# EAGLE design rt_ctl (EAGLE 5.06)
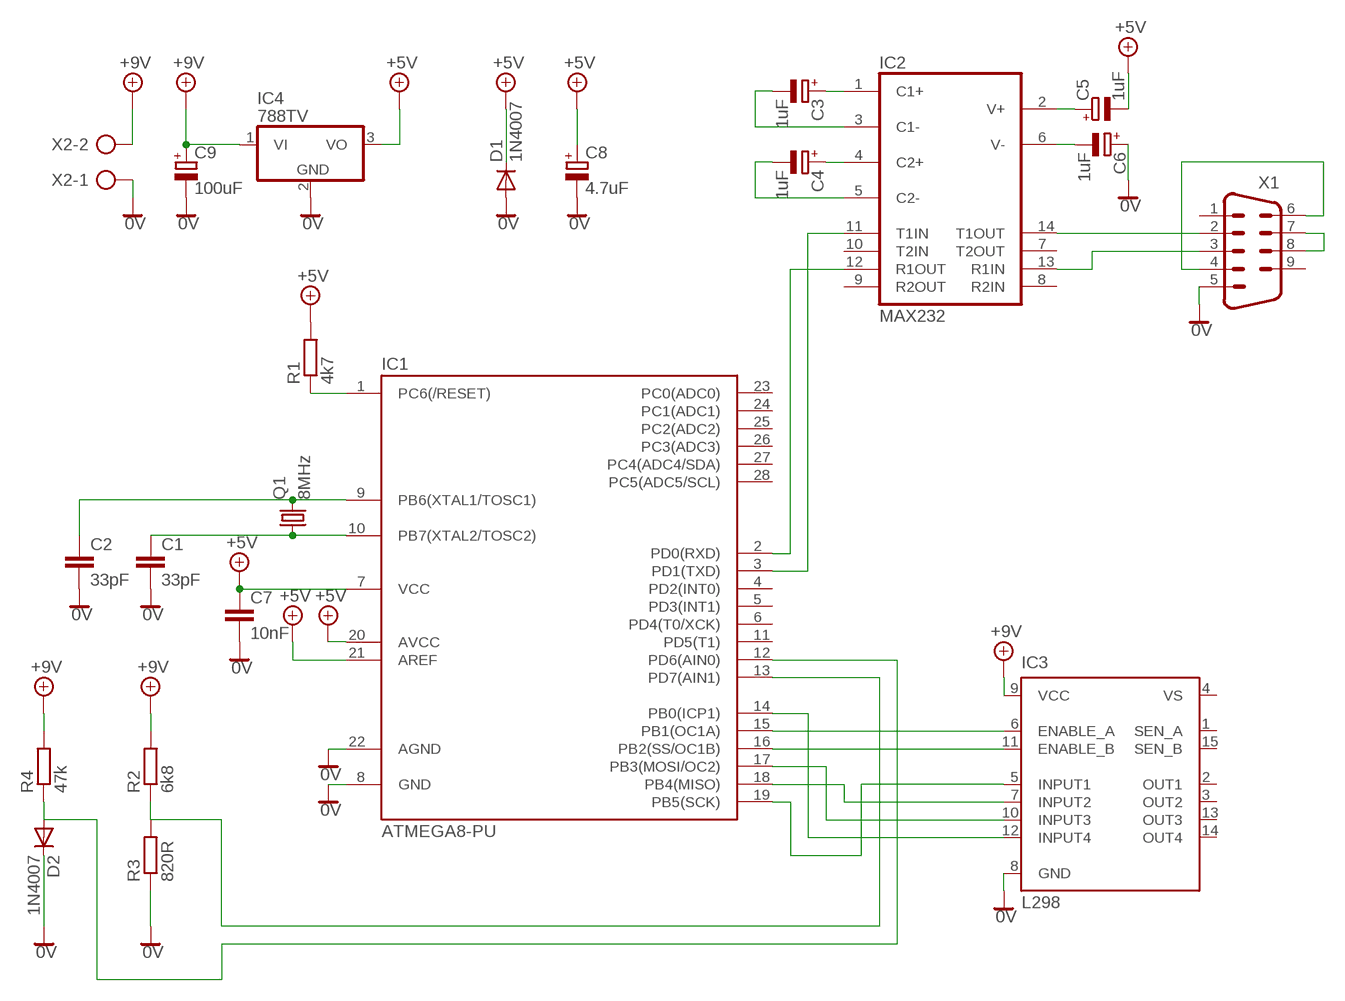
[diagram p0: schematic, sheet 1]

## Parts
C1  33pF  C7.5/3  [C7.5B3]
C2  33pF  C7.5/3  [C7.5B3]
C3  1uF  CPOL-EUE2.5-5  [E2,5-5]
C4  1uF  CPOL-EUE2.5-5  [E2,5-5]
C5  1uF  CPOL-EUE2.5-5  [E2,5-5]
C6  1uF  CPOL-EUE2.5-5  [E2,5-5]
C7  10nF  C7.5/3  [C7.5B3]
C8  4.7uF  CPOL-EUE2.5-7  [E2,5-7]
C9  100uF  CPOL-EUE3.5-10  [E3,5-10]
D1  1N4007  1N4004  [DO41-10]
D2  1N4007  1N4004  [DO41-10]
IC1  ATMEGA8-PU  [DIL28-3]
IC2  MAX232  [DIL16]
IC3  L298  [MULTIWATT-15]
IC4  788TV  [TO220V]
Q1  8MHz  CRYSTALHC49U-V  [HC49U-V]
R1  4k7  R-EU_0207/12  [0207/12]
R2  6k8  R-EU_0207/12  [0207/12]
R3  820R  R-EU_0207/12  [0207/12]
R4  47k  R-EU_0207/12  [0207/12]
X1  M09HP  [M09HP]
X2  AK300/2  [AK300/2]

## Nets
0V: C1.2 C2.2 C6.+ C7.2 C8.- C9.- D1.A D2.C IC1.8(GND) IC1.22(AGND) IC3.8(GND) IC4.2(GND) R3.1 X1.5 X2.1
+5V: C5.- C7.1 C8.+ D1.C IC1.7(VCC) IC1.20(AVCC) IC1.21(AREF) IC4.3(VO) R1.2
+9V: C9.+ IC3.9(VCC) IC4.1(VI) R2.2 R4.2 X2.2
N$1: C2.1 IC1.9(PB6(XTAL1/TOSC1)) Q1.2
N$2: C1.1 IC1.10(PB7(XTAL2/TOSC2)) Q1.1
N$3: IC1.1(PC6(/RESET)) R1.1
N$4: IC1.2(PD0(RXD)) IC2.12(R1OUT)
N$5: IC1.3(PD1(TXD)) IC2.11(T1IN)
N$6: C3.+ IC2.1(C1+)
N$7: C4.+ IC2.4(C2+)
N$8: C5.+ IC2.2(V+)
N$9: C6.- IC2.6(V-)
N$10: C3.- IC2.3(C1-)
N$11: C4.- IC2.5(C2-)
N$12: IC2.14(T1OUT) X1.2
N$13: IC2.13(R1IN) X1.3
N$14: D2.A IC1.12(PD6(AIN0)) R4.1
N$15: X1.7 X1.8
N$16: X1.4 X1.6
N$17: IC1.15(PB1(OC1A)) IC3.6(ENABLE_A)
N$18: IC1.16(PB2(SS/OC1B)) IC3.11(ENABLE_B)
N$19: IC1.14(PB0(ICP1)) IC3.12(INPUT4)
N$20: IC1.19(PB5(SCK)) IC3.5(INPUT1)
N$21: IC1.18(PB4(MISO)) IC3.7(INPUT2)
N$22: IC1.17(PB3(MOSI/OC2)) IC3.10(INPUT3)
N$25: IC1.13(PD7(AIN1)) R2.1 R3.2
Unconnected: IC1.4(PD2(INT0)) IC1.5(PD3(INT1)) IC1.6(PD4(T0/XCK)) IC1.11(PD5(T1)) IC1.23(PC0(ADC0)) IC1.24(PC1(ADC1)) IC1.25(PC2(ADC2)) IC1.26(PC3(ADC3)) IC1.27(PC4(ADC4/SDA)) IC1.28(PC5(ADC5/SCL)) IC2.7(T2OUT) IC2.8(R2IN) IC2.9(R2OUT) IC2.10(T2IN) IC3.1(SEN_A) IC3.2(OUT1) IC3.3(OUT2) IC3.13(OUT3) IC3.14(OUT4) IC3.15(SEN_B) X1.1 X1.9

## Power pins joined to a net without a drawn wire
GND: IC2.15(GND)
VCC: IC2.16(VCC)
VS: IC3.4(VS)

## Library data of the parts
C1 C2 C7 = capacitor-wima:C: CAPACITOR naming: grid - package width
C3-C6 C8 C9 = rcl:CPOL-EU: POLARIZED CAPACITOR, European symbol
D1 D2 = diode:1N4004: DIODE general purpose rectifier, 1 A
IC1 = atmega8:ATMEGA8-PU
IC2 = maxim:MAX232: RS232 TRANSEIVER
IC3 = st-microelectronics:L298: DUAL FULL-BRIDGE DRIVER
IC4 = linear:78*: Positive VOLTAGE REGULATOR Source: http://cache.national.com/ds/LM/LM78L05.pdf http://www.fairchildsemi.com/ds/LM/LM7805.pdf
Q1 = crystal:CRYSTAL: CRYSTAL
R1-R4 = resistor:R-EU_: RESISTOR, European symbol
X1 = con-subd:M09: SUB-D
X2 = con-ptr500:AK300/2: CONNECTOR

## Board
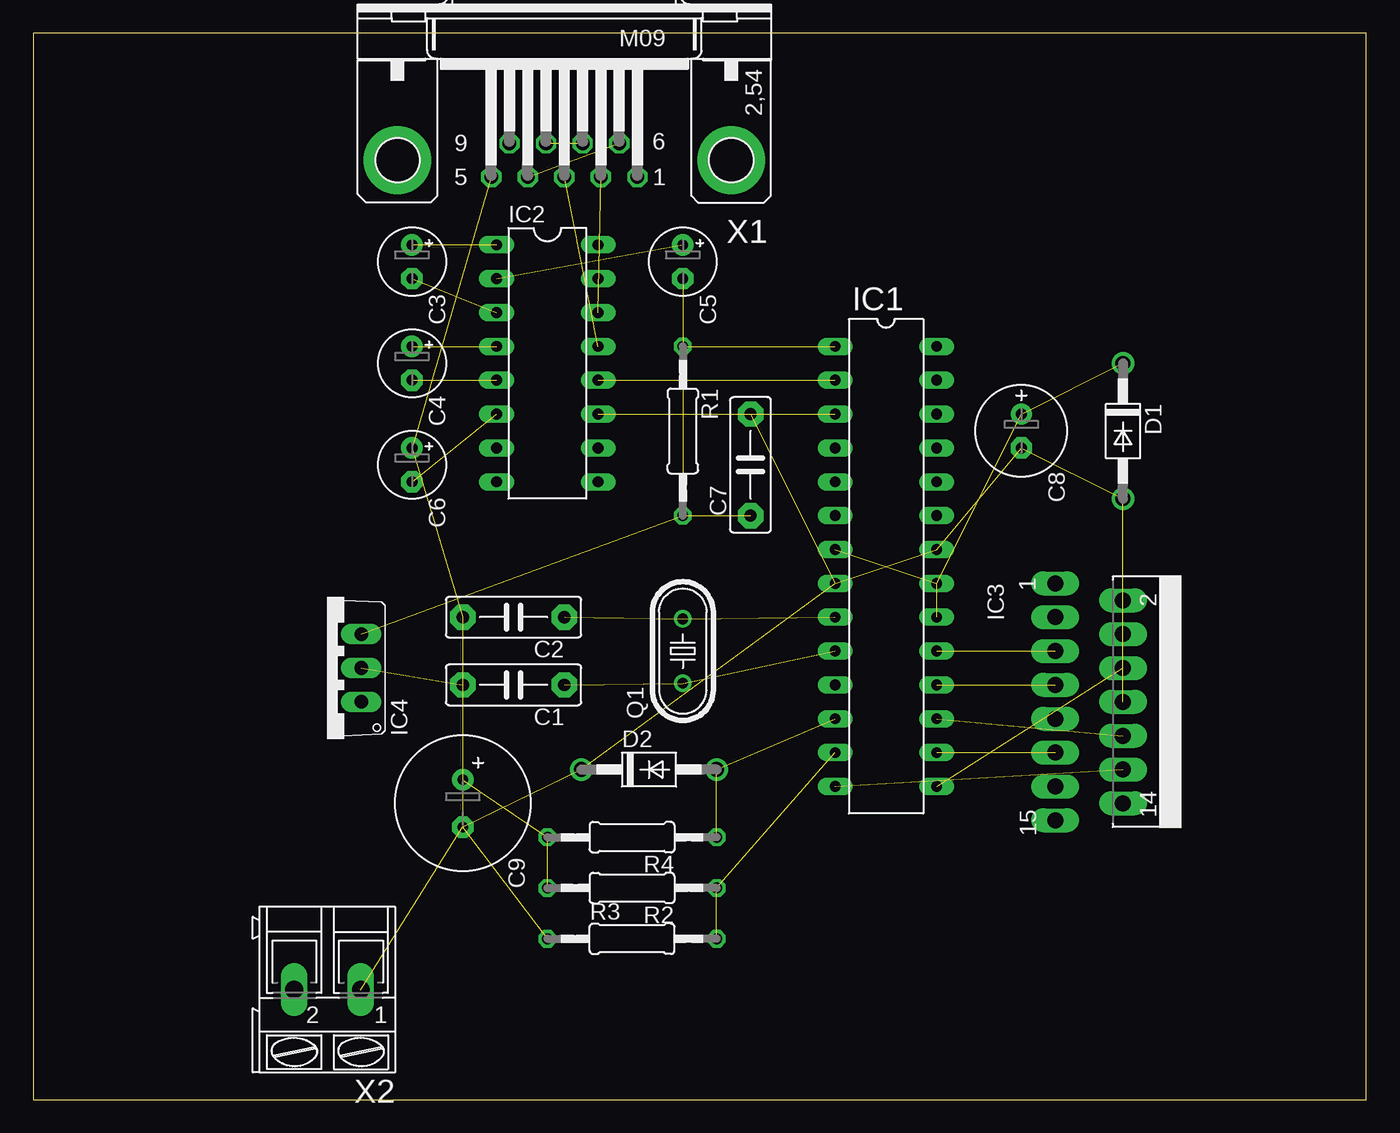
[diagram p1: board, top side]
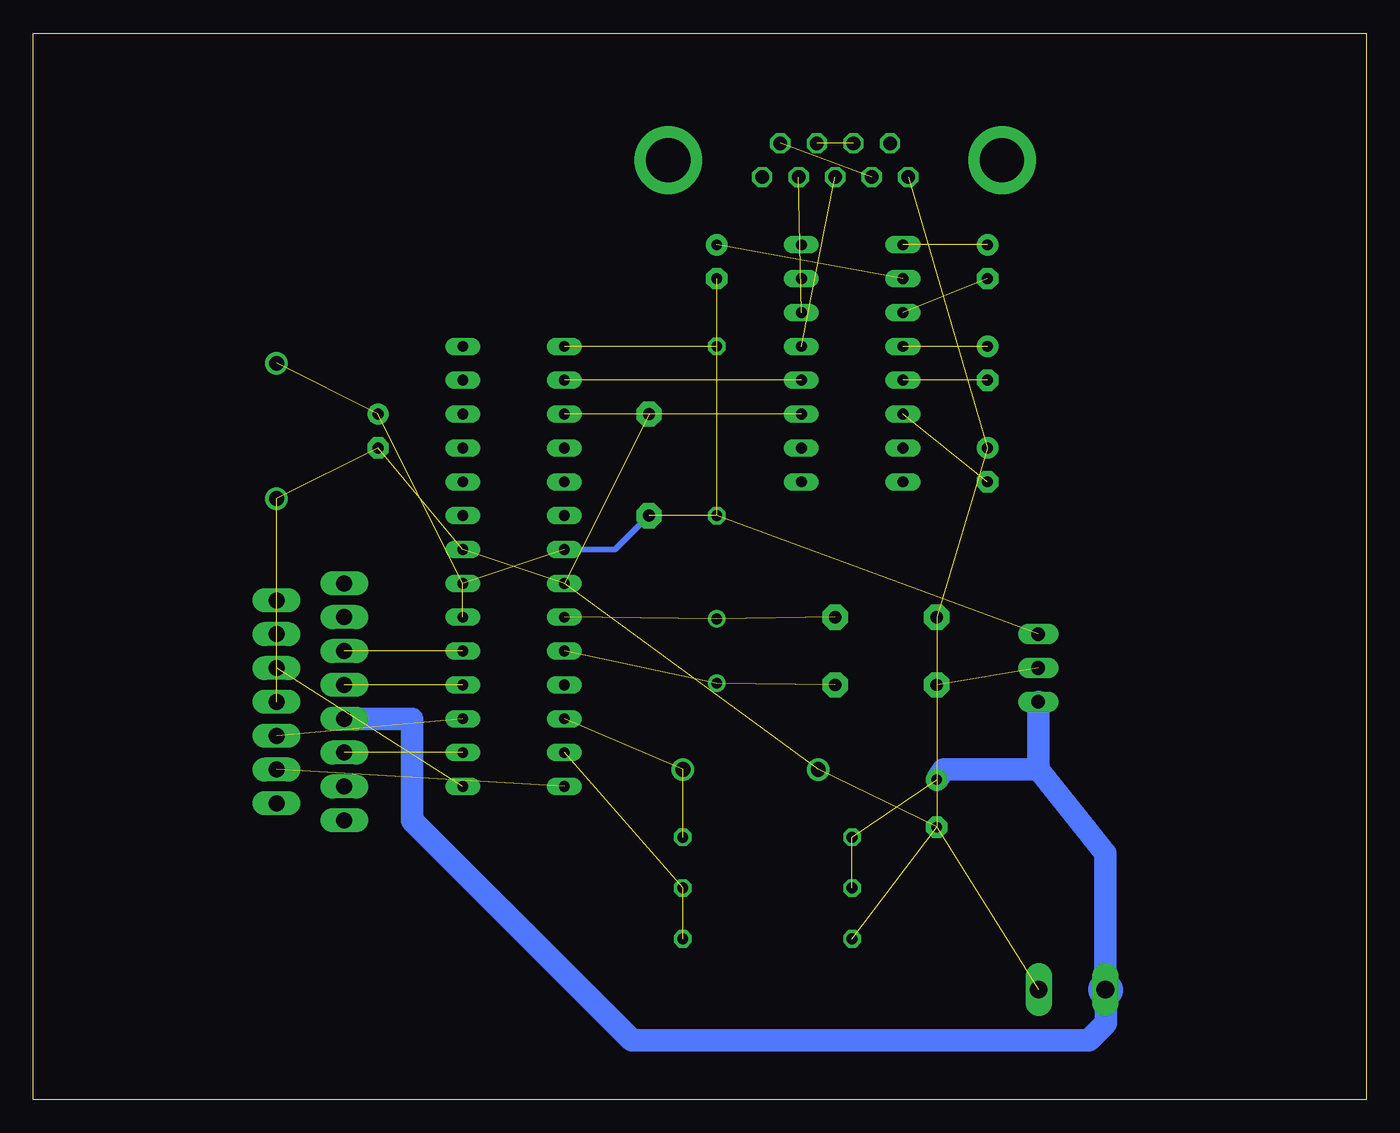
[diagram p2: board, bottom side, seen from below]

Size 100 x 80 mm. Coordinates in mm from the lower left corner, seen from the top.
Outline: 0,0 100,0 100,80 0,80 0,0
Copper layers (1*16): Top 0.035mm / dielectric 1.5mm / Bottom 0.035mm
Design rules "default": minimum track width 10mil, minimum drill 24mil, track to track 8mil, track to pad 8mil, pad to pad 8mil, via to via 8mil, smd to smd 8mil, copper to edge 40mil, drill to drill 8mil, minimum pad ring 10mil, minimum via ring 8mil, stop-mask expansion 4mil, vias tented up to drill 0mil, thermal gap 10mil

### Footprints (pad centres in the part's own frame; a part is rotated, then mirrored left to right if it is on the bottom)
C7.5B3 = drill 0.914 pad 1.905 octagon: 1 -3.81,0; 2 3.81,0
E2,5-5 = drill 0.813 pad 1.6 round: + -1.27,0 | drill 0.813 pad 1.6 octagon: - 1.27,0
E2,5-7 = drill 0.813 pad 1.6 round: + -1.27,0 | drill 0.813 pad 1.6 octagon: - 1.27,0
E3,5-10 = drill 0.813 pad 1.6 round: + -1.778,0 | drill 0.813 pad 1.6 octagon: - 1.778,0
DO41-10 = drill 1.118 round: A 5.08,0; C -5.08,0
DIL28-3 = drill 0.813 long: 1 -16.51,-3.81; 2 -13.97,-3.81; 3 -11.43,-3.81; 4 -8.89,-3.81; 5 -6.35,-3.81; 6 -3.81,-3.81; 7 -1.27,-3.81; 8 1.27,-3.81; 9 3.81,-3.81; 10 6.35,-3.81; 11 8.89,-3.81; 12 11.43,-3.81; 13 13.97,-3.81; 14 16.51,-3.81; 15 16.51,3.81; 16 13.97,3.81; 17 11.43,3.81; 18 8.89,3.81; 19 6.35,3.81; 20 3.81,3.81; 21 1.27,3.81; 22 -1.27,3.81; 23 -3.81,3.81; 24 -6.35,3.81; 25 -8.89,3.81; 26 -11.43,3.81; 27 -13.97,3.81; 28 -16.51,3.81
DIL16 = drill 0.813 long: 1 -8.89,-3.81; 2 -6.35,-3.81; 3 -3.81,-3.81; 4 -1.27,-3.81; 5 1.27,-3.81; 6 3.81,-3.81; 7 6.35,-3.81; 8 8.89,-3.81; 9 8.89,3.81; 10 6.35,3.81; 11 3.81,3.81; 12 1.27,3.81; 13 -1.27,3.81; 14 -3.81,3.81; 15 -6.35,3.81; 16 -8.89,3.81
MULTIWATT-15 = drill 1.2 long: 1 -8.89,-7.62; 2 -7.62,-2.54; 3 -6.35,-7.62; 4 -5.08,-2.54; 5 -3.81,-7.62; 6 -2.54,-2.54; 7 -1.27,-7.62; 8 0,-2.54; 9 1.27,-7.62; 10 2.54,-2.54; 11 3.81,-7.62; 12 5.08,-2.54; 13 6.35,-7.62; 14 7.62,-2.54; 15 8.89,-7.62
TO220V = drill 1.016 long: 1 -2.54,-2.54; 2 0,-2.54; 3 2.54,-2.54
HC49U-V = drill 0.813 round: 1 -2.413,0; 2 2.413,0
0207/12 = drill 0.813 octagon: 1 -6.35,0; 2 6.35,0
M09HP = drill 1.016 octagon: 1 -5.486,1.27; 2 -2.743,1.27; 3 0,1.27; 4 2.743,1.27; 5 5.486,1.27; 6 -4.115,-1.27; 7 -1.372,-1.27; 8 1.372,-1.27; 9 4.115,-1.27 | drill 3.302 pad 5.08 round: G1 -12.522,0; G2 12.522,0
AK300/2 = drill 1.321 long: 1 -2.515,0; 2 2.489,0

### Placement (x,y rotation side)
C1  36.03,31.11 180 top
C2  36.03,36.19 180 top
C3  28.41,62.86 270 top
C4  28.41,55.24 270 top
C5  48.73,62.86 270 top
C6  28.41,47.62 270 top
C7  53.81,47.62 90 top
C8  74.13,50.16 270 top
C9  32.22,22.22 270 top
D1  81.75,50.16 270 top
D2  46.19,24.76 0 top
IC1  63.97,40 270 top
IC2  38.57,55.24 270 top
IC3  84.29,29.84 270 top
IC4  22.06,32.38 90 top
Q1  48.73,33.65 90 top
R1  48.73,50.16 270 top
R2  44.92,15.87 180 top
R3  44.92,12.06 0 top
R4  44.92,19.68 180 top
X1  39.84,70.48 180 top
X2  22.06,8.25 180 top

### Tracks (layer width: path | path; a pad name or v marks a point on that pad's centre or on a via)
0V  (14 unrouted)
+5V  (7 unrouted)
  Bottom 0.406: IC1.7 56.35,41.27 C7.1
+9V  (2 unrouted)
  Bottom 1.676: X2.2 19.57,18.46 24.6,24.76 | 24.6,24.76 31.71,24.76 C9.+ | 24.6,24.76 IC4.1 | IC3.9 71.59,28.57 71.59,20.95 55.08,4.44 20.79,4.44 19.52,5.71 19.52,8.2
  Bottom 2.54: 19.52,8.2 X2.2
N$1  (2 unrouted)
N$2  (2 unrouted)
N$3  (1 unrouted)
N$4  (1 unrouted)
N$5  (1 unrouted)
N$6  (1 unrouted)
N$7  (1 unrouted)
N$8  (1 unrouted)
N$9  (1 unrouted)
N$10  (1 unrouted)
N$11  (1 unrouted)
N$12  (1 unrouted)
N$13  (1 unrouted)
N$14  (2 unrouted)
N$15  (1 unrouted)
N$16  (1 unrouted)
N$17  (1 unrouted)
N$18  (1 unrouted)
N$19  (1 unrouted)
N$20  (1 unrouted)
N$21  (1 unrouted)
N$22  (1 unrouted)
N$25  (2 unrouted)